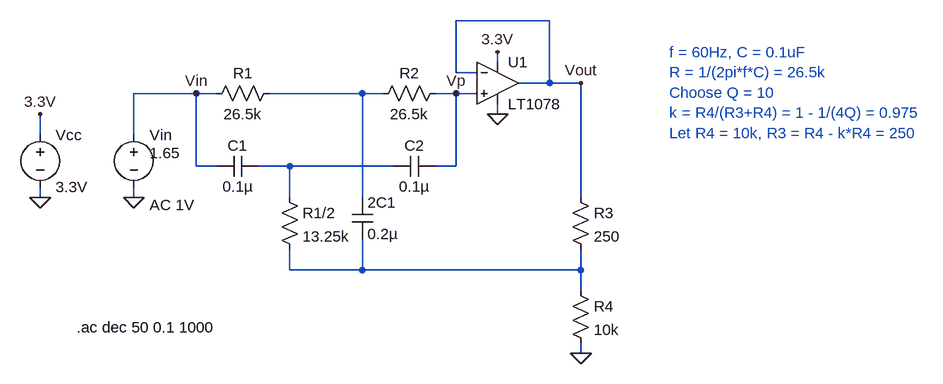
[diagram p0: schematic 60Hz_Notch_Filter.asc]
60Hz_Notch_Filter.asc, the LTspice schematic file:
Version 4
SHEET 1 1268 680
WIRE 624 64 480 64
WIRE 544 128 544 112
WIRE 480 144 480 64
WIRE 512 144 480 144
WIRE 624 160 624 64
WIRE 624 160 576 160
WIRE 672 160 624 160
WIRE 80 176 -16 176
WIRE 112 176 80 176
WIRE 336 176 192 176
WIRE 368 176 336 176
WIRE 480 176 448 176
WIRE 512 176 480 176
WIRE 544 208 544 192
WIRE -160 240 -160 208
WIRE -16 240 -16 176
WIRE 80 288 80 176
WIRE 112 288 80 288
WIRE 224 288 176 288
WIRE 384 288 224 288
WIRE 480 288 480 176
WIRE 480 288 448 288
WIRE -160 336 -160 320
WIRE -16 336 -16 320
WIRE 224 336 224 288
WIRE 336 336 336 176
WIRE 672 336 672 160
WIRE 224 448 224 416
WIRE 336 448 336 400
WIRE 336 448 224 448
WIRE 672 448 672 416
WIRE 672 448 336 448
WIRE 672 480 672 448
WIRE 672 576 672 560
FLAG 672 576 0
FLAG 544 208 0
FLAG -16 336 0
FLAG -160 336 0
FLAG 544 112 3.3V
FLAG -160 208 3.3V
FLAG 672 160 Vout
FLAG 80 176 Vin
FLAG 480 176 Vp
SYMBOL res 208 320 R0
SYMATTR InstName R1/2
SYMATTR Value 13.25k
SYMBOL res 96 192 R270
WINDOW 0 32 56 VTop 2
WINDOW 3 0 56 VBottom 2
SYMATTR InstName R1
SYMATTR Value 26.5k
SYMBOL res 352 192 R270
WINDOW 0 32 56 VTop 2
WINDOW 3 0 56 VBottom 2
SYMATTR InstName R2
SYMATTR Value 26.5k
SYMBOL res 656 320 R0
SYMATTR InstName R3
SYMATTR Value 250
SYMBOL res 656 464 R0
SYMATTR InstName R4
SYMATTR Value 10k
SYMBOL cap 320 336 R0
SYMATTR InstName 2C1
SYMATTR Value 0.2µ
SYMBOL cap 112 304 R270
WINDOW 0 32 32 VTop 2
WINDOW 3 0 32 VBottom 2
SYMATTR InstName C1
SYMATTR Value 0.1µ
SYMBOL cap 384 304 R270
WINDOW 0 32 32 VTop 2
WINDOW 3 0 32 VBottom 2
SYMATTR InstName C2
SYMATTR Value 0.1µ
SYMBOL OpAmps\\LT1078 544 96 R0
SYMATTR InstName U1
SYMBOL voltage -16 224 R0
WINDOW 123 24 124 Left 2
WINDOW 39 0 0 Left 0
WINDOW 3 24 44 Left 2
SYMATTR Value2 AC 1V
SYMATTR InstName Vin
SYMATTR Value 1.65
SYMBOL voltage -160 224 R0
WINDOW 123 0 0 Left 0
WINDOW 39 0 0 Left 0
SYMATTR InstName Vcc
SYMATTR Value 3.3V
TEXT -104 536 Left 2 !.ac dec 50 0.1 1000
TEXT 808 112 Left 2 ;f = 60Hz, C = 0.1uF\nR = 1/(2pi*f*C) = 26.5k\nChoose Q = 10\nk = R4/(R3+R4) = 1 - 1/(4Q) = 0.975\nLet R4 = 10k, R3 = R4 - k*R4 = 250

The netlist it stands for:
* 60Hz_Notch_Filter.asc
R1/2 N002 N003 13.25k
R1 Vin N001 26.5k
R2 N001 Vp 26.5k
R3 Vout N003 250
R4 N003 0 10k
C§2C1 N001 N003 0.2µ
C1 Vin N002 0.1µ
C2 N002 Vp 0.1µ
XU1 Vp Vout 3.3V 0 Vout LT1078  ; pins In+ In- V+ V- OUT
Vin Vin 0 1.65 AC 1V
Vcc 3.3V 0 3.3V
.ac dec 50 0.1 1000
* f = 60Hz, C = 0.1uF
* R = 1/(2pi*f*C) = 26.5k
* Choose Q = 10
* k = R4/(R3+R4) = 1 - 1/(4Q) = 0.975
* Let R4 = 10k, R3 = R4 - k*R4 = 250
.backanno
.end